# EAGLE design pie-shield (EAGLE 6.4)
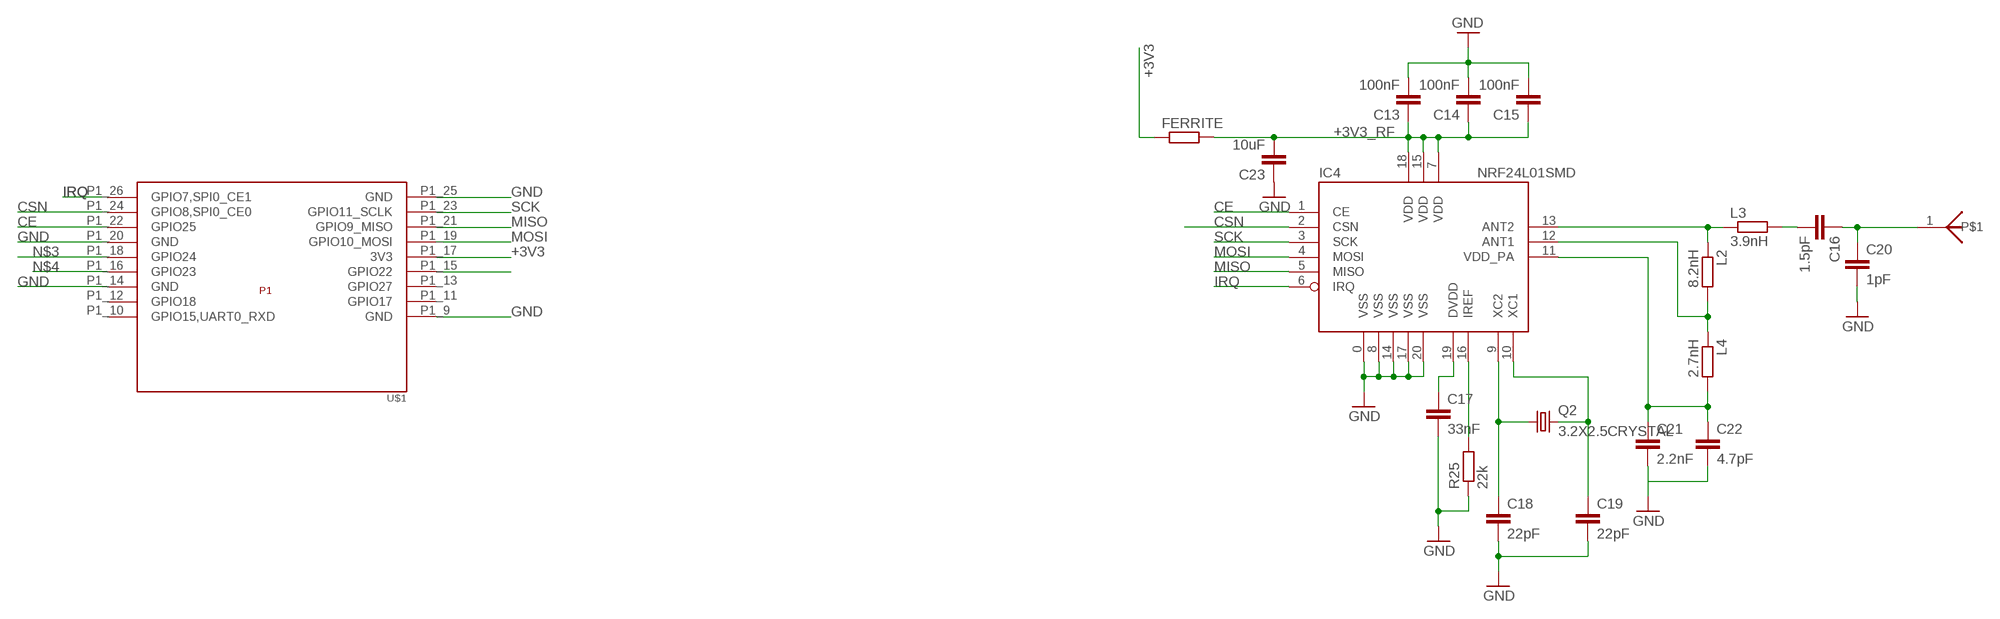
[diagram p0: schematic, sheet 1]

## Parts
ANT  CHIPANTENNA  [CHIPANTENNA]
C13  100nF  C-EUC0402K  [C0402K]
C14  100nF  C-EUC0402K  [C0402K]
C15  100nF  C-EUC0402K  [C0402K]
C16  1.5pF  C-EUC0402K  [C0402K]
C17  33nF  C-EUC0402K  [C0402K]
C18  22pF  C-EUC0402K  [C0402K]
C19  22pF  C-EUC0402K  [C0402K]
C20  1pF  C-EUC0402K  [C0402K]
C21  2.2nF  C-EUC0402K  [C0402K]
C22  4.7pF  C-EUC0402K  [C0402K]
C23  10uF  C-EUC0805K  [C0805K]
FERRITE  R-EU_R0805  [R0805]
IC4  NRF24L01SMD  [QFN20]
L2  8.2nH  R-EU_R0402  [R0402]
L3  3.9nH  R-EU_R0402  [R0402]
L4  2.7nH  R-EU_R0402  [R0402]
Q2  3.2X2.5CRYSTAL  [CRYSTAL3.2X2.5]
R25  22k  R-EU_R0603  [R0603]
U$1  RASPBERRY-PI_REV2  [RASPBERRY-PI_REV2]

## Nets
+3V3 [GND/3V3]: FERRITE.1 U$1.P1_17(3V3)
+3V3_RF: C13.1 C14.1 C15.1 C23.2 FERRITE.2 IC4.7(VDD) IC4.15(VDD) IC4.18(VDD)
CE: IC4.1(CE) U$1.P1_22(GPIO25)
CSN: IC4.2(CSN) U$1.P1_24(GPIO8,SPI0_CE0)
GND [GND/3V3]: C13.2 C14.2 C15.2 C17.2 C18.2 C19.2 C20.2 C21.2 C22.2 C23.1 IC4.0(VSS) IC4.8(VSS) IC4.14(VSS) IC4.17(VSS) IC4.20(VSS) R25.1 U$1.P1_9(GND) U$1.P1_14(GND) U$1.P1_20(GND) U$1.P1_25(GND)
IRQ: IC4.6(IRQ) U$1.P1_26(GPIO7,SPI0_CE1)
MISO: IC4.5(MISO) U$1.P1_21(GPIO9_MISO)
MOSI: IC4.4(MOSI) U$1.P1_19(GPIO10_MOSI)
N$1: U$1.P1_15(GPIO22)
N$3: U$1.P1_18(GPIO24)
N$4: U$1.P1_16(GPIO23)
N$10: C18.1 IC4.9(XC2) Q2.1
N$11: C19.1 IC4.10(XC1) Q2.3
N$12 [GND/3V3]: ANT.1 C16.1 C20.1
N$70: C17.1 IC4.19(DVDD)
N$71: IC4.16(IREF) R25.2
N$73: C21.1 C22.1 IC4.11(VDD_PA) L4.2
N$78: IC4.12(ANT1) L2.2 L4.1
N$79: IC4.13(ANT2) L2.1 L3.1
N$80: C16.2 L3.2
SCK: IC4.3(SCK) U$1.P1_23(GPIO11_SCLK)
Unconnected: U$1.P1_10(GPIO15,UART0_RXD) U$1.P1_11(GPIO17) U$1.P1_12(GPIO18) U$1.P1_13(GPIO27)

## Library data of the parts
ANT = badge:CHIPANTENNA
C13-C23 = rcl:C-EU: CAPACITOR, European symbol
FERRITE L2-L4 R25 = rcl:R-EU_: RESISTOR, European symbol
IC4 = SparkFun:NRF24L01: 2.4GHz Low Power Transceiver This is the very popular, low cost, very low power RF transceiver from Nordic Semiconductor. Simple SPI interface. SKU: COM-00690
Q2 = badge:3.2X2.5CRYSTAL
U$1 = RaspberryPi:RASPBERRY-PI_REV2: Raspberry Pi Board <http://www.raspberrypi.org/> Jacques Lagnel V1.0 (beta) 2012 Mateusz Bawaj V1.1 (beta) 2012 Board dimension: Forum 3D model <http://www.raspberrypi.org/forum/general-discussion/mechanical-profile-3d-models?value=3d%20model&type=1&include=1&search=1&ret=all> The GPIO Connector (P1): http://elinux.org/RPi_Low-level_peripherals The GPIO Connector (P5): http://www.raspberrypi-spy.co.uk/2012/09/raspberry-pi-p5-header/

## Net classes
2 GND/3V3: width 0.2 mm, drill 0.4 mm

## Board
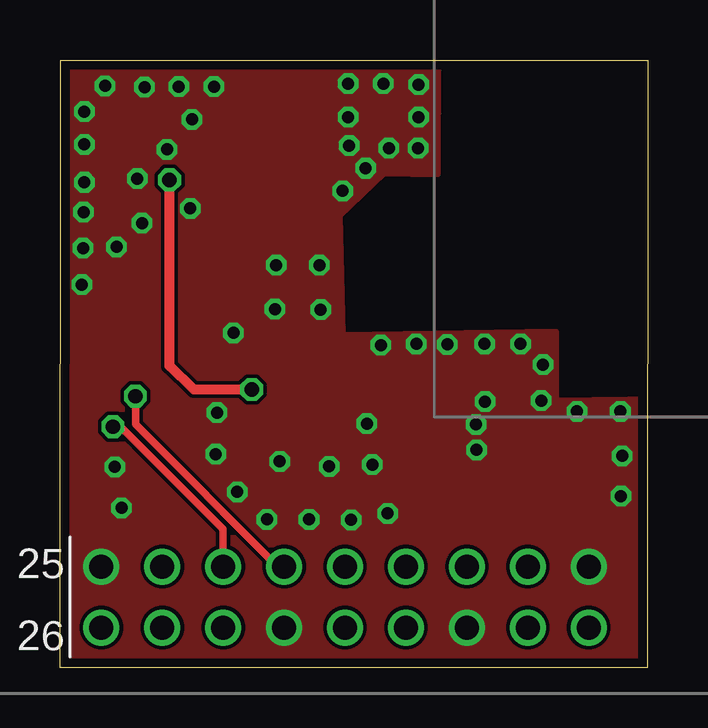
[diagram p1: board, top side]
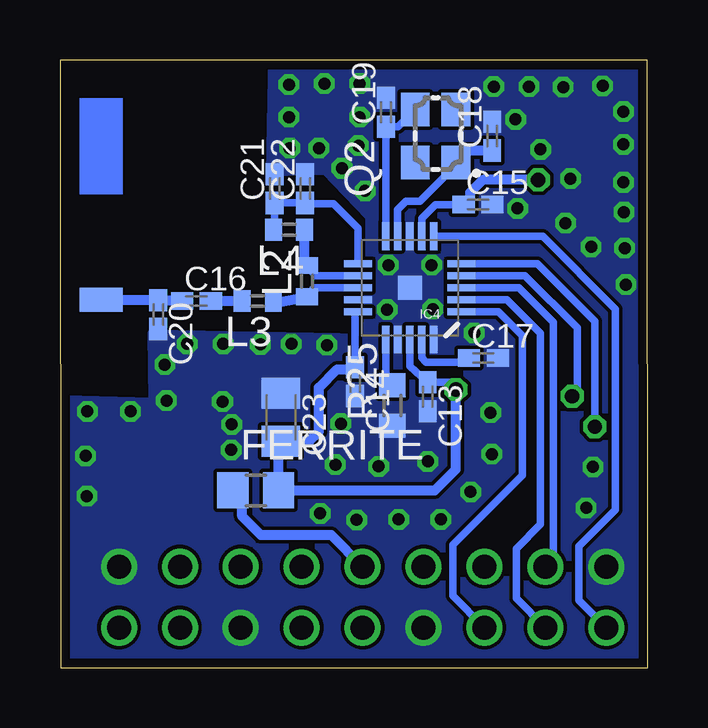
[diagram p2: board, bottom side, seen from below]

Size 24.51 x 25.31 mm. Coordinates in mm from the lower left corner, seen from the top.
Outline: 24.48,0 0,0 0.03,25.31 24.51,25.31 24.48,0
Copper layers (1*16): Top 0.0356mm / dielectric 1.5011mm / Bottom 0.0356mm
Design rules "LaenPCBOrder": minimum track width 6mil, minimum drill 13mil, track to track 6mil, track to pad 6mil, pad to pad 6mil, via to via 6mil, smd to smd 6mil, copper to edge 15mil, drill to drill 6mil, minimum pad ring 7mil, minimum via ring 7mil, stop-mask expansion 4mil, vias tented up to drill 0mil, thermal gap 10mil

### Footprints (pad centres in the part's own frame; a part is rotated, then mirrored left to right if it is on the bottom)
CHIPANTENNA = smd 1 x 1.8: 1 -2.45,0
C0402K = smd 0.925 x 0.74: 1 -0.6,0; 2 0.6,0
C0805K = smd 1.3 x 1.6: 1 -1,0; 2 1,0
R0805 = smd 1.3 x 1.5: 1 -0.95,0; 2 0.95,0
QFN20 = smd 1 x 1: 0 0,0 | smd 1.158 x 0.3: 1 -2.154,1; 2 -2.154,0.5; 3 -2.154,0; 4 -2.154,-0.5; 5 -2.154,-1; 11 2.154,-1; 12 2.154,-0.5; 13 2.154,0; 14 2.154,0.5; 15 2.154,1 | smd 0.3 x 1.158: 6 -1,-2.154; 7 -0.5,-2.154; 8 0,-2.154; 9 0.5,-2.154; 10 1,-2.154; 16 1,2.154; 17 0.5,2.154; 18 0,2.154; 19 -0.5,2.154; 20 -1,2.154
R0402 = smd 0.7 x 0.9: 1 -0.65,0; 2 0.65,0
CRYSTAL3.2X2.5 = smd 1.4 x 1.2: 1 -1.1,-0.85; 2 1.1,-0.85; 3 1.1,0.85; 4 -1.1,0.85
R0603 = smd 1 x 1.1: 1 -0.85,0; 2 0.85,0
RASPBERRY-PI_REV2 = drill 1: P1_9 -31.75,21.59; P1_10 -31.75,24.13; P1_11 -29.21,21.59; P1_12 -29.21,24.13; P1_13 -26.67,21.59; P1_14 -26.67,24.13; P1_15 -24.13,21.59; P1_16 -24.13,24.13; P1_17 -21.59,21.59; P1_18 -21.59,24.13; P1_19 -19.05,21.59; P1_20 -19.05,24.13; P1_21 -16.51,21.59; P1_22 -16.51,24.13; P1_23 -13.97,21.59; P1_24 -13.97,24.13; P1_25 -11.43,21.59; P1_26 -11.43,24.13

### Placement (x,y rotation side)
ANT  22.79,17.78 90 bottom
C13  9.18,11.28 270 bottom
C14  12.2,11.91 270 bottom
C15  7.08,19.29 0 bottom
C16  18.82,15.28 0 bottom
C17  6.85,12.89 0 bottom
C18  6.49,22.14 90 bottom
C19  10.91,23.14 90 bottom
C20  20.41,14.71 270 bottom
C21  15.56,19.96 90 bottom
C22  14.29,19.96 90 bottom
C23  15.3,10.43 270 bottom
FERRITE  16.35,7.38 0 bottom
IC4  9.92,15.82 180 bottom
L2  14.21,16.1 90 bottom
L3  16.27,15.28 180 bottom
L4  14.96,18.24 180 bottom
Q2  8.85,22.14 90 bottom
R25  10.65,10.91 90 bottom
U$1  -9.7,25.79 180 top

### Tracks (layer width: path | path; a pad name or v marks a point on that pad's centre or on a via)
+3V3
  Bottom 0.406: FERRITE.1 16.91,7 16.91,6.3 16.13,5.51 13.19,5.51 U$1.P1_17
+3V3_RF  (via drill 0.6)
  Top 0.406: v8,11.58 5.59,11.58 4.57,12.57 v4.57,20.32
  Bottom 0.305: C15.1 8.85,19.29 9.42,18.72 IC4.7 | IC4.15 12.2,14.74 C14.1 | IC4.18 9.92,12.55 C13.1 8.3,11.88 v8,11.58 | 15.4,9.32 C23.2
  Bottom 0.406: C23.2 14.12,9.43 13.71,9.83 13.71,11.66 12.95,12.42 12.29,12.42 C14.1 | v8,11.58 8,8.25 8.87,7.38 FERRITE.2 15.4,9.32 | v4.57,20.32 6.88,20.32 7.41,19.79 7.44,19.53 C15.1
CE
  Bottom 0.305: IC4.1 6.23,14.82 5.23,13.82 5.23,8 8.13,5.11 8.13,2.98 U$1.P1_22
CSN
  Bottom 0.305: IC4.2 5.87,15.32 4.47,13.92 4.47,5.97 5.48,4.95 5.48,2.88 U$1.P1_24
GND  (via drill 0.5)
  other vias: 12.06,21.74 13.48,24.33 13.71,21.64 0.91,15.95 2.28,8.36 23.37,10.67 21.56,10.67 20.06,11.13 20.14,12.62 19.2,13.49 17.7,13.49 13.38,13.44 14.96,22.94 14.96,24.28 12.01,22.94 14.93,21.64 12.75,20.8 12.8,10.16 5.43,19.13 12.01,24.33 5.51,22.83 6.42,24.21 11.78,19.86 14.86,13.49 23.44,8.81 23.39,7.14 6.5,8.89 2.56,6.65 17.73,11.07 17.35,10.13 2.36,17.53 16.15,13.46 4.95,24.21 3.22,20.37 3.53,24.18 1.88,24.23 1.01,23.16 1.01,21.79 1.01,20.22 0.99,18.97 0.96,17.48 6.55,10.62 9.17,8.59 7.39,7.32 8.63,6.17 10.39,6.17 12.14,6.15 13.66,6.43 11.22,8.38 4.47,21.59 3.43,18.52 7.24,13.94 13.03,8.46 17.37,9.07 9.01,16.76 8.96,14.94 10.87,14.91 10.82,16.76
  pour Bottom (no thermals): 25.07,11.23 20.67,11.1 20.7,13.92 11.71,13.77 11.63,18.77 13.46,20.68 15.77,20.62 15.67,25.6 -0.49,25.5 -0.43,-0.33 24.94,-0.2
  pour Top (no thermals): -0.38,-0.46 24.94,-0.13 25.19,11.15 20.65,11.1 20.65,13.97 11.76,13.82 11.63,18.85 13.48,20.62 15.72,20.57 15.75,25.5 -0.38,25.5
IRQ
  Bottom 0.305: IC4.6 4.38,17.97 1.34,14.93 1.34,6.58 2.87,5.05 2.87,2.8 U$1.P1_26
MISO  (via drill 0.6)
  Top 0.305: v2.21,10.03 2.54,10.03 6.81,5.76 U$1.P1_21
  Bottom 0.305: IC4.5 4.6,16.82 2.21,14.43 v2.21,10.03
MOSI  (via drill 0.6)
  Top 0.305: v3.15,11.3 3.15,10.13 9.08,4.2 U$1.P1_19
  Bottom 0.305: IC4.4 5.12,16.32 2.94,14.15 2.94,11.51 v3.15,11.3
N$10
  Bottom 0.305: Q2.1 8,20.93 9.5,19.43 10.08,19.43 10.44,19.08 10.44,17.99 IC4.9
  Bottom 0.406: C18.1 8.07,21.54 Q2.1
N$11
  Bottom 0.305: IC4.10 10.91,17.98 C19.1 10.41,22.54 Q2.3
N$12
  Bottom 0.305: 22.77,15.31 ANT.1
  Bottom 0.406: C16.1 19.48,15.31 C20.1 22.77,15.31
N$70
  Bottom 0.305: IC4.19 9.42,12.9 9.24,12.73 7.62,12.73 C17.1
N$71
  Bottom 0.305: R25.2 10.92,12.19 IC4.16
N$73
  Bottom 0.305: IC4.11 12.08,18.3 13.1,19.33 14.26,19.33 C22.1 C21.1 15.56,18.37 L4.2
N$78
  Bottom 0.305: IC4.12 13.88,16.32 L2.2
  Bottom 0.406: L2.2 14.31,16.98 L4.1
N$79
  Bottom 0.305: IC4.13 13.91,15.82 L2.1
  Bottom 0.406: L3.1 15.29,15.24 L2.1
N$80
  Bottom 0.406: C16.2 L3.2
SCK
  Bottom 0.305: IC4.3 5.38,15.82 3.93,14.38 3.93,4.54 U$1.P1_23